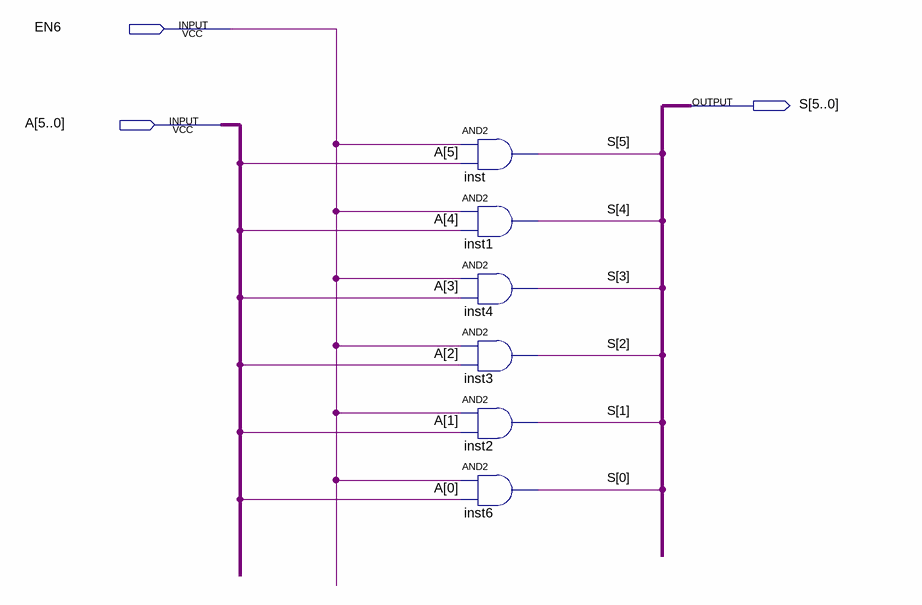
[diagram p0: schematic sheet]
// Quartus schematic Enabler6bits.bdf as structural Verilog: 6 symbols, 3 pins
module Enabler6bits (
  input  EN6,
  input  [5:0] A,
  output [5:0] S
);

  and inst (S[5], EN6, A[5]);
  and inst1 (S[4], EN6, A[4]);
  and inst4 (S[3], EN6, A[3]);
  and inst3 (S[2], EN6, A[2]);
  and inst2 (S[1], EN6, A[1]);
  and inst6 (S[0], EN6, A[0]);
endmodule
